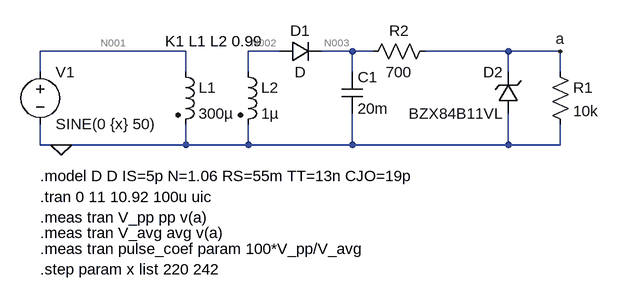
[diagram p0: schematic 1.8.asc]
1.8.asc, the LTspice schematic file:
Version 4
SHEET 1 1076 680
WIRE 320 80 96 80
WIRE 464 80 416 80
WIRE 576 80 528 80
WIRE 608 80 576 80
WIRE 816 80 688 80
WIRE 896 80 816 80
WIRE 96 112 96 80
WIRE 320 112 320 80
WIRE 416 112 416 80
WIRE 576 112 576 80
WIRE 816 112 816 80
WIRE 896 112 896 80
WIRE 96 224 96 192
WIRE 128 224 96 224
WIRE 320 224 320 192
WIRE 320 224 128 224
WIRE 416 224 416 192
WIRE 416 224 320 224
WIRE 576 224 576 176
WIRE 576 224 416 224
WIRE 816 224 816 176
WIRE 816 224 576 224
WIRE 896 224 896 192
WIRE 896 224 816 224
FLAG 128 224 0
FLAG 896 80 a
SYMBOL voltage 96 96 R0
WINDOW 123 0 0 Left 0
WINDOW 39 0 0 Left 0
SYMATTR InstName V1
SYMATTR Value SINE(0 {x} 50)
SYMBOL ind2 304 96 R0
SYMATTR InstName L1
SYMATTR Value 300µ
SYMATTR SpiceLine Rser=10m
SYMATTR Type ind
SYMBOL ind2 400 96 R0
SYMATTR InstName L2
SYMATTR Value 1µ
SYMATTR SpiceLine Rser=10m
SYMATTR Type ind
SYMBOL diode 464 96 R270
WINDOW 0 32 32 VTop 2
WINDOW 3 0 32 VBottom 2
SYMATTR InstName D1
SYMBOL cap 560 112 R0
SYMATTR InstName C1
SYMATTR Value 20m
SYMBOL res 880 96 R0
SYMATTR InstName R1
SYMATTR Value 10k
SYMBOL res 704 64 R90
WINDOW 0 0 56 VBottom 2
WINDOW 3 32 56 VTop 2
SYMATTR InstName R2
SYMATTR Value 700
SYMBOL zener 832 176 R180
WINDOW 0 24 64 Left 2
WINDOW 3 24 0 Left 2
SYMATTR InstName D2
SYMATTR Value BZX84B11VL
SYMATTR Description Diode
SYMATTR Type diode
TEXT 96 272 Left 2 !.model D D IS=5p N=1.06 RS=55m TT=13n CJO=19p
TEXT 96 304 Left 2 !.tran 0 11 10.92 100u uic
TEXT 96 336 Left 2 !.meas tran V_pp pp v(a)
TEXT 96 360 Left 2 !.meas tran V_avg avg v(a)
TEXT 96 384 Left 2 !.meas tran pulse_coef param 100*V_pp/V_avg
TEXT 288 64 Left 2 !K1 L1 L2 0.99
TEXT 96 416 Left 2 !.step param x list 220 242

The netlist it stands for:
* 1.8.asc
V1 N001 0 SINE(0 {x} 50)
L1 N001 0 300µ Rser=10m
L2 N002 0 1µ Rser=10m
D1 N002 N003 D
C1 N003 0 20m
R1 a 0 10k
R2 a N003 700
D2 0 a BZX84B11VL
.model D D
.lib standard.dio
.model D D IS=5p N=1.06 RS=55m TT=13n CJO=19p
.tran 0 11 10.92 100u uic
.meas tran V_pp pp v(a)
.meas tran V_avg avg v(a)
.meas tran pulse_coef param 100*V_pp/V_avg
K1 L1 L2 0.99
.step param x list 220 242
.backanno
.end

* Results of the author's LTspice run, read from the files saved beside the schematic
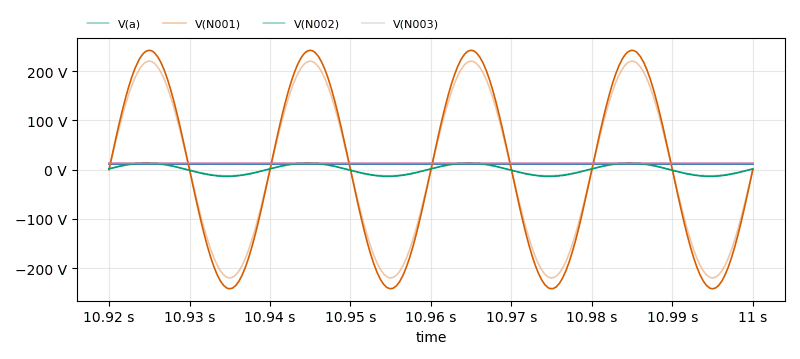
[diagram p1: Transient Analysis of 1.8.asc, plotted from the saved traces]
* Transient Analysis, 2 runs:
*   V(a) [x=220]: min 10.98 V, max 10.98 V, average 10.98 V, rms 10.98 V, last 10.98 V
*   V(a) [x=242]: min 10.99 V, max 10.99 V, average 10.99 V, rms 10.99 V, last 10.99 V
*   V(N001) [x=220]: min -220 V, max 220 V, average 26.76 mV, rms 155.6 V, last 0 V
*   V(N001) [x=242]: min -242 V, max 242 V, average 29.11 mV, rms 171.1 V, last 0 V
*   V(N002) [x=220]: min -12.5 V, max 12.5 V, average 1.634 mV, rms 8.842 V, last 1.319 V
*   V(N002) [x=242]: min -13.75 V, max 13.75 V, average 1.762 mV, rms 9.726 V, last 1.451 V
*   V(N003) [x=220]: min 11.86 V, max 11.86 V, average 11.86 V, rms 11.86 V, last 11.86 V
*   V(N003) [x=242]: min 13.08 V, max 13.08 V, average 13.08 V, rms 13.08 V, last 13.08 V
* From the log:
*   Measurement: v_pp
*     step  PP(v(a))  FROM  TO
*        1  6.38962e-005  0  0.08
*        2  1.52588e-005  0  0.08
*   Measurement: v_avg
*     step  AVG(v(a))  FROM  TO
*        1  10.978  0  0.08
*        2  10.9942  0  0.08
*   Measurement: pulse_coef
*     step  100*v_pp/v_avg
*        1  0.000582039
*        2  0.000138789